# EAGLE design 16segclock (EAGLE 6.5.0)
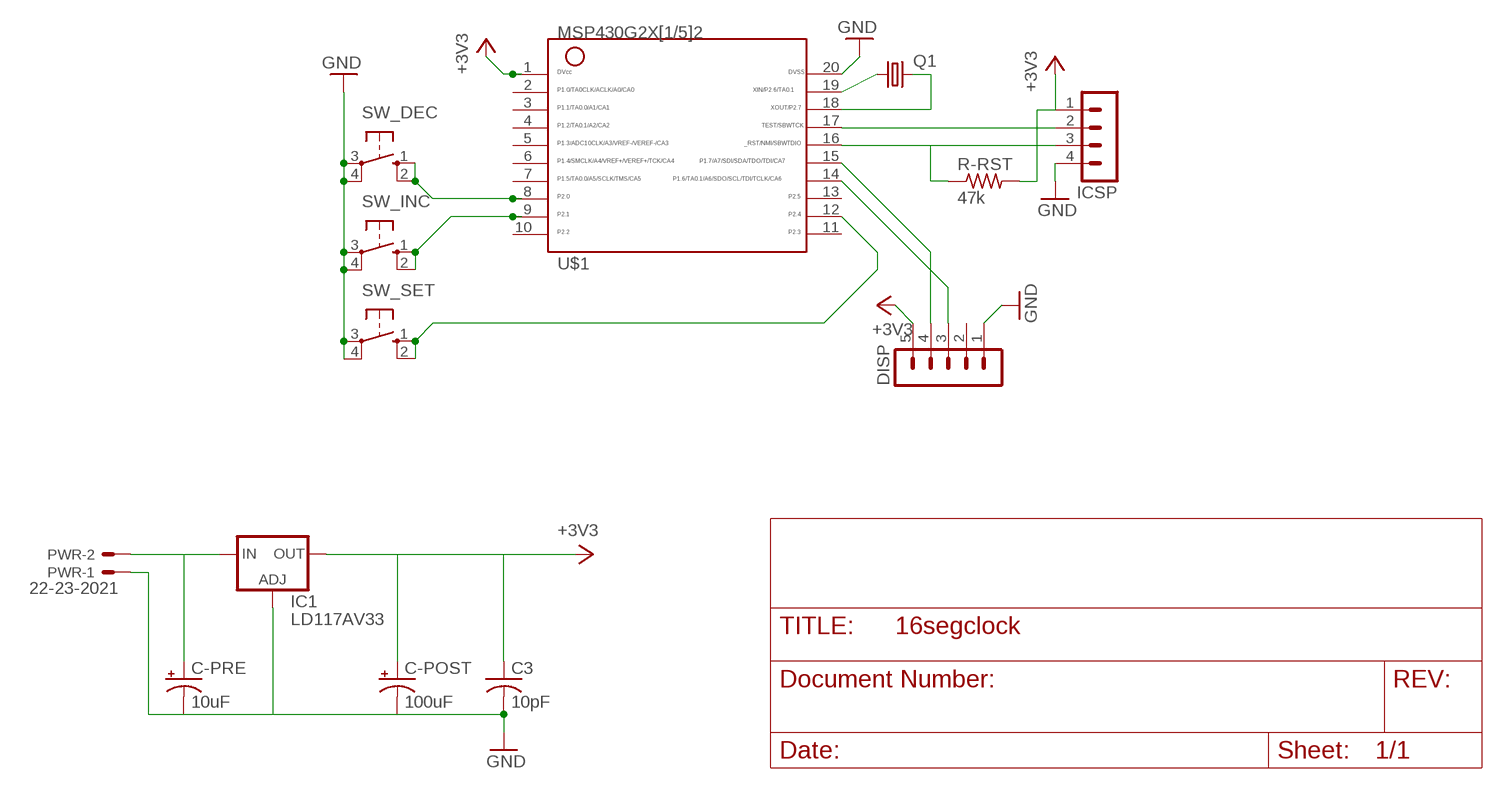
[diagram p0: schematic, sheet 1]

## Parts
C3  10pF  C-USC0805  [C0805]
C-POST  100uF  CPOL-USE3.5-8  [E3,5-8]
C-PRE  10uF  CPOL-USE2.5-6  [E2,5-6]
DISP  MA05-1  [MA05-1]
IC1  LD117AV33  [TO220L1]
ICSP  MA04-1  [MA04-1]
PWR  22-23-2021  [22-23-2021]
Q1  CRYSTALTC38H  [TC38H]
R-RST  47k  R-US_R0805  [R0805]
SW_DEC  10-XX  [B3F-10XX]
SW_INC  10-XX  [B3F-10XX]
SW_SET  10-XX  [B3F-10XX]
U$1  G2X[1/5]2---N20  [N20]

## Nets
!REST: ICSP.3 R-RST.1 U$1.16
+3V3: C3.1 C-POST.+ DISP.5 IC1.2(OUT) ICSP.1 R-RST.2 U$1.1
GND: C3.2 C-POST.- C-PRE.- DISP.1 IC1.1(ADJ) ICSP.4 PWR.1 SW_DEC.3(P) SW_DEC.4(P1) SW_INC.3(P) SW_INC.4(P1) SW_SET.3(P) SW_SET.4(P1) U$1.20
N$2: C-PRE.+ IC1.3(IN) PWR.2
N$3: Q1.1 U$1.19
N$4: Q1.2 U$1.18
SCL: DISP.3 U$1.14
SDA: DISP.4 U$1.15
SW_DEC: SW_DEC.1(S) SW_DEC.2(S1) U$1.8
SW_INC: SW_INC.1(S) SW_INC.2(S1) U$1.9
SW_SET: SW_SET.1(S) SW_SET.2(S1) U$1.12
TEST: ICSP.2 U$1.17
Unconnected: DISP.2 U$1.2 U$1.3 U$1.4 U$1.5 U$1.6 U$1.7 U$1.10 U$1.11 U$1.13

## Library data of the parts
C3 = resistor:C-US: CAPACITOR, American symbol
C-POST C-PRE = resistor:CPOL-US: POLARIZED CAPACITOR, American symbol
DISP = con-lstb:MA05-1: PIN HEADER; OC_FARNELL: unknown; OC_NEWARK: unknown
IC1 = v-reg:LD117A?*: Low drop fixed and adjustable positive voltage regulators 1 A Source: http://www.st.com/stonline/products/literature/ds/7194/ld1117axx.pdf
ICSP = con-lstb:MA04-1: PIN HEADER; OC_FARNELL: unknown; OC_NEWARK: unknown
PWR = con-molex:22-23-2021: .100" (2.54mm) Center Header - 2 Pin; MF: MOLEX; MPN: 22-23-2021; OC_FARNELL: 1462926; OC_NEWARK: 25C3832
Q1 = crystal:CRYSTAL: CRYSTAL; OC_FARNELL: unknown; OC_NEWARK: unknown
R-RST = resistor:R-US_: RESISTOR, American symbol
SW_DEC SW_INC SW_SET = switch-omron:10-XX: OMRON SWITCH; MPN: B3F-1000; OC_FARNELL: 176432; OC_NEWARK: 36M3542
U$1 = TI_MSP430_v16:G2X[1/5]2---N20: MSP430G2X[1/5]2 MSP430G2x52, MSP430G2x12 PDIP (N) 20 Pin Package http://focus.ti.com/docs/prod/folders/print/msp430g2452.html

## Board
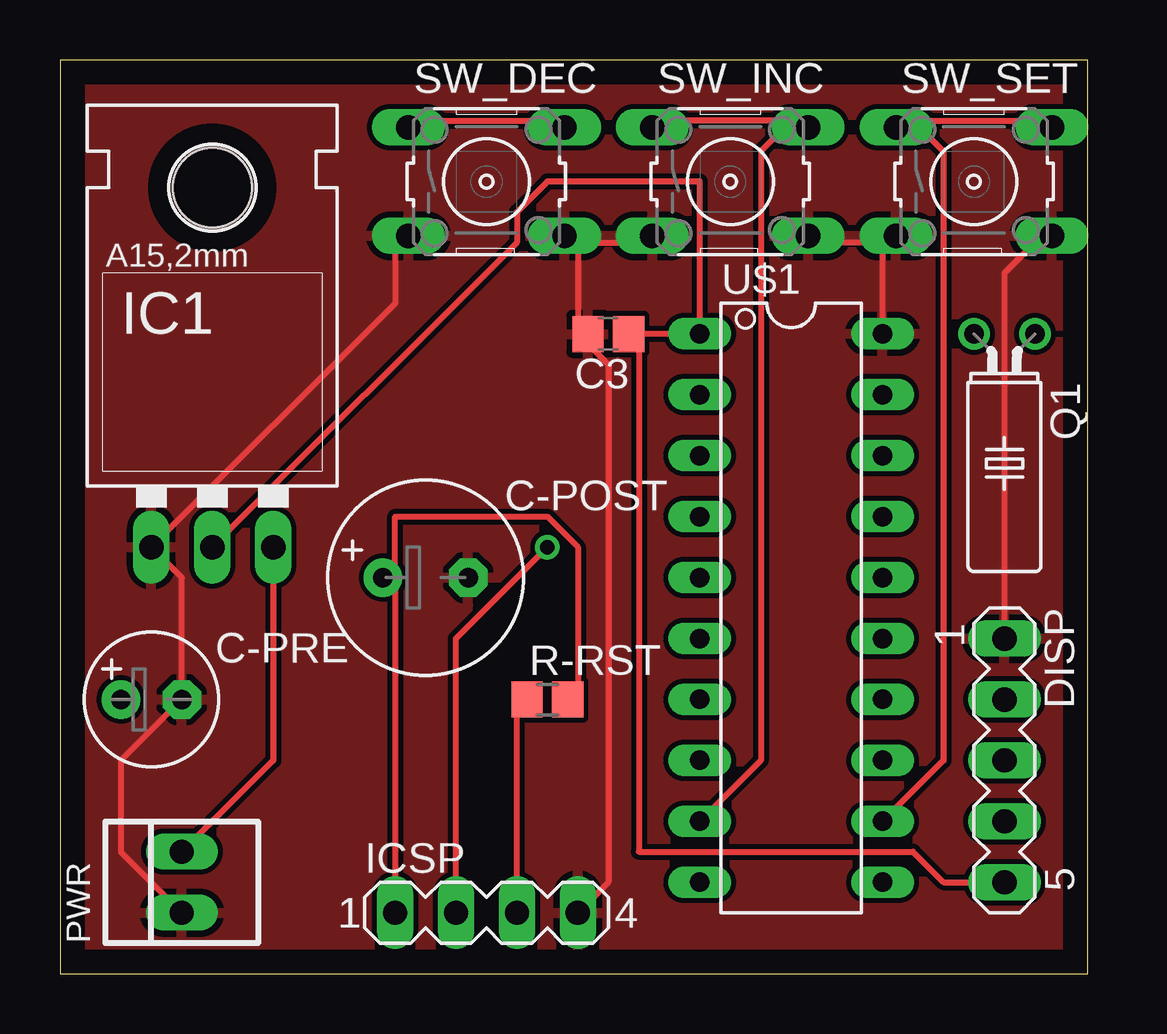
[diagram p1: board, top side]
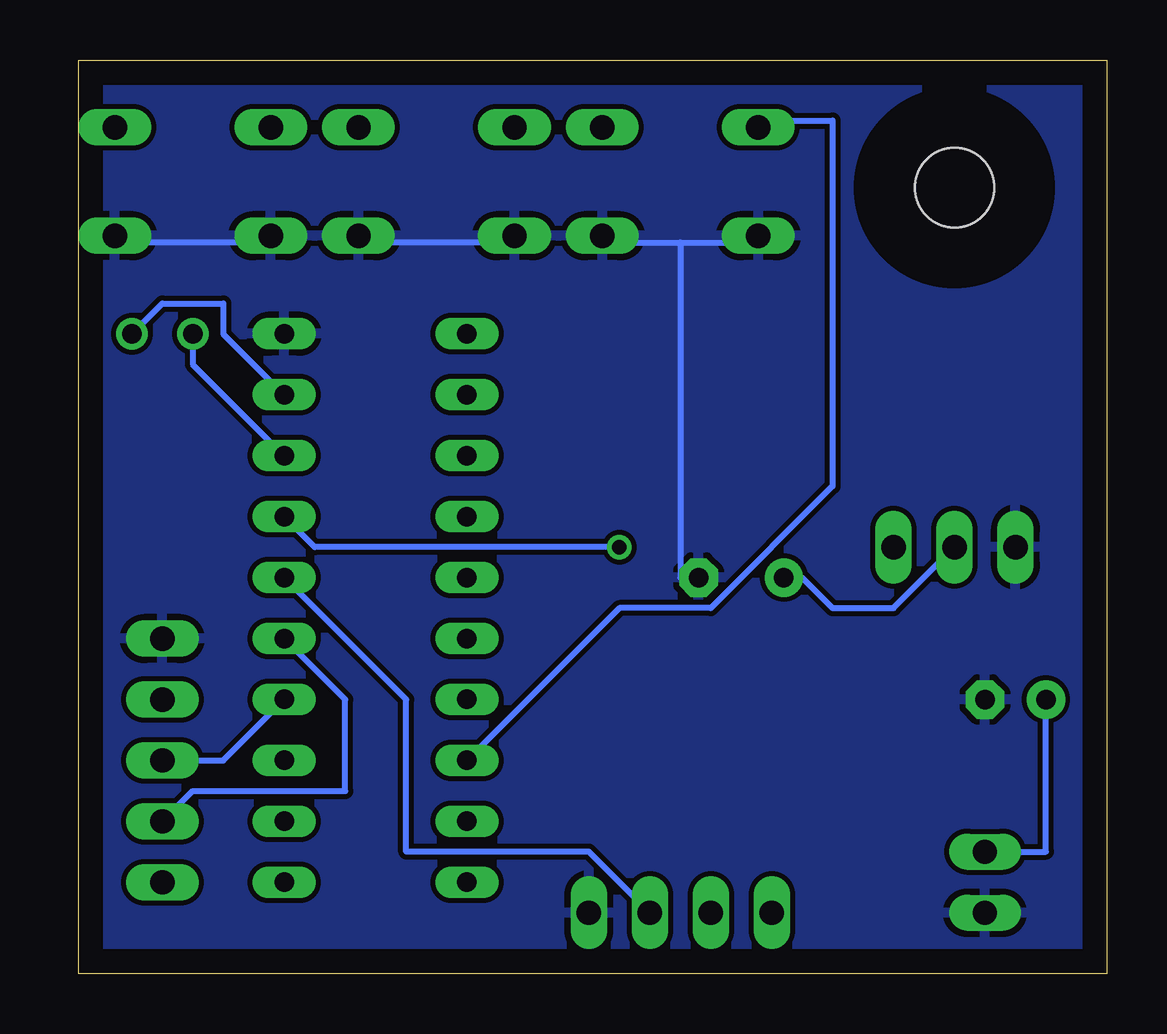
[diagram p2: board, bottom side, seen from below]

Size 42.85 x 38.09 mm. Coordinates in mm from the lower left corner, seen from the top.
Outline: 0,0 42.85,0 42.85,38.09 0,38.09 0,0
Copper layers (1*16): Top 0.035mm / dielectric 1.5mm / Bottom 0.035mm
Design rules "default": minimum track width 10mil, minimum drill 24mil, track to track 8mil, track to pad 8mil, pad to pad 8mil, via to via 8mil, smd to smd 8mil, copper to edge 40mil, drill to drill 8mil, minimum pad ring 10mil, minimum via ring 8mil, stop-mask expansion 4mil, vias tented up to drill 0mil, thermal gap 10mil

### Footprints (pad centres in the part's own frame; a part is rotated, then mirrored left to right if it is on the bottom)
C0805 = smd 1.3 x 1.5: 1 -0.85,0; 2 0.85,0
E3,5-8 = drill 0.813 pad 1.6: + -1.778,0 | drill 0.813 pad 1.6 octagon: - 1.778,0
E2,5-6 = drill 0.813 pad 1.6: + -1.27,0 | drill 0.813 pad 1.6 octagon: - 1.27,0
MA05-1 = drill 1.016 long: 1 -5.08,0; 2 -2.54,0; 3 0,0; 4 2.54,0; 5 5.08,0
TO220L1 = drill 1.016 long: 1 -2.54,-3.81; 2 0,-3.81; 3 2.54,-3.81 | hole 3.302: 0,11.176
MA04-1 = drill 1.016 long: 1 -3.81,0; 2 -1.27,0; 3 1.27,0; 4 3.81,0
22-23-2021 = drill 1 long: 1 -1.27,0; 2 1.27,0
TC38H = drill 0.813: 1 -1.27,0; 2 1.27,0
R0805 = smd 1.3 x 1.5: 1 -0.85,0; 2 0.85,0
B3F-10XX = drill 1.016 long: 1 -3.251,2.261; 2 3.251,2.261; 3 -3.251,-2.261; 4 3.251,-2.261
N20 = drill 0.813 long: 1 -11.435,-3.81; 2 -8.895,-3.81; 3 -6.355,-3.81; 4 -3.815,-3.81; 5 -1.275,-3.81; 6 1.265,-3.81; 7 3.805,-3.81; 8 6.345,-3.81; 9 8.885,-3.81; 10 11.425,-3.81; 11 11.425,3.81; 12 8.885,3.81; 13 6.345,3.81; 14 3.805,3.81; 15 1.265,3.81; 16 -1.275,3.81; 17 -3.815,3.81; 18 -6.355,3.81; 19 -8.895,3.81; 20 -11.435,3.81

### Placement (x,y rotation side)
C3  22.86,26.67 180 top
C-POST  15.24,16.51 0 top
C-PRE  3.81,11.43 0 top
DISP  39.37,8.89 270 top
IC1  6.35,21.59 0 top
ICSP  17.78,2.54 0 top
PWR  5.08,3.81 90 top
Q1  39.37,26.67 180 top
R-RST  20.32,11.43 0 top
SW_DEC  17.78,33.02 0 top
SW_INC  27.94,33.02 0 top
SW_SET  38.1,33.02 0 top
U$1  30.48,15.24 270 top

### Tracks (layer width: path | path; a pad name or v marks a point on that pad's centre or on a via)
!REST
  Top 0.254: ICSP.3 19.05,11.43 R-RST.1
  Bottom 0.254: ICSP.3 21.59,5.08 29.21,5.08 29.21,11.43 U$1.16
+3V3
  Top 0.254: 13.97,16.51 13.97,19.05 20.32,19.05 21.59,17.78 21.59,11.43 R-RST.2 | 13.97,16.51 ICSP.1 | 13.97,16.51 C-POST.+ | 24.13,26.67 U$1.1 26.67,33.02 20.32,33.02 19.05,31.75 19.05,30.48 IC1.2 | DISP.5 36.83,3.81 35.56,5.08 24.13,5.08 24.13,26.67 | 24.13,26.67 C3.1
  Bottom 0.254: IC1.2 8.89,15.24 11.43,15.24 12.7,16.51 C-POST.+
GND
  Top 0.254: DISP.1 39.37,29.21 40.64,30.48 SW_SET.4 | PWR.1 2.54,5.08 2.54,8.89 C-PRE.- 5.08,16.51 IC1.1 13.97,27.94 13.97,30.48 SW_DEC.3 | 34.29,30.48 U$1.20 | 34.29,30.48 31.75,30.48 SW_INC.4 | 34.29,30.48 SW_SET.3 | 21.59,30.48 21.59,26.67 | ICSP.4 22.86,3.81 22.86,25.4 21.59,26.67 | 21.59,26.67 C3.2 | 21.59,30.48 24.13,30.48 SW_INC.3 | 21.59,30.48 SW_DEC.4
  Bottom 0.254: 17.78,30.48 20.32,30.48 SW_DEC.4 | 17.78,30.48 15.24,30.48 SW_DEC.3 | 17.78,30.48 17.78,16.51 C-POST.- | SW_INC.4 30.48,30.48 25.4,30.48 SW_INC.3 | SW_SET.4 40.64,30.48 35.56,30.48 SW_SET.3
  pour Top: 0,38.1 43.18,38.1 43.18,0 0,0
  pour Bottom: 0,38.1 43.18,38.1 43.18,0 0,0
N$2
  Top 0.254: PWR.2 8.89,8.89 IC1.3
  Bottom 0.254: C-PRE.+ 2.54,5.08 PWR.2
N$3
  Bottom 0.254: Q1.1 39.37,27.94 36.83,27.94 36.83,26.67 U$1.19
N$4
  Bottom 0.254: Q1.2 38.1,25.4 U$1.18
SCL
  Bottom 0.254: DISP.3 36.83,8.89 U$1.14
SDA
  Bottom 0.254: DISP.4 38.1,7.62 31.75,7.62 31.75,11.43 U$1.15
SW_DEC
  Top 0.254: SW_DEC.2 20.32,35.56 15.24,35.56 SW_DEC.1
  Bottom 0.254: U$1.8 20.32,15.24 16.51,15.24 11.43,20.32 11.43,35.56 13.97,35.56 SW_DEC.1
SW_INC
  Top 0.254: 30.48,35.56 29.21,34.29 29.21,8.89 U$1.9 | 30.48,35.56 25.4,35.56 SW_INC.1 | 30.48,35.56 SW_INC.2
SW_SET
  Top 0.254: 35.56,35.56 36.83,34.29 36.83,8.89 U$1.12 | 35.56,35.56 40.64,35.56 SW_SET.2 | 35.56,35.56 SW_SET.1
TEST  (via drill 0.61)
  Top 0.254: v20.32,17.78 16.51,13.97 ICSP.2
  Bottom 0.254: v20.32,17.78 33.02,17.78 U$1.17

### Text on the board
tDocu: 3V | TEST | !RST | GND | AMV 08-2013